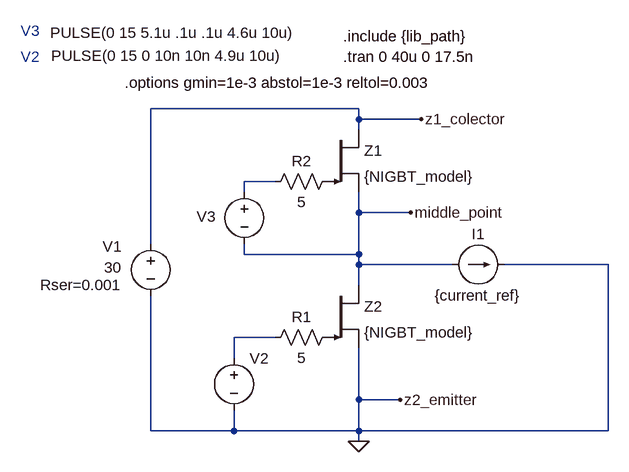
[diagram p0: schematic Abaixador_rv00.asc]
Abaixador_rv00.asc, the LTspice schematic file:
Version 4
SHEET 1 880 824
WIRE -816 -816 -1136 -816
WIRE -816 -800 -816 -816
WIRE -720 -800 -816 -800
WIRE -816 -784 -816 -800
WIRE -944 -704 -992 -704
WIRE -992 -688 -992 -704
WIRE -816 -656 -816 -688
WIRE -736 -656 -816 -656
WIRE -816 -592 -816 -656
WIRE -1136 -608 -1136 -816
WIRE -992 -592 -992 -608
WIRE -816 -592 -992 -592
WIRE -816 -576 -816 -592
WIRE -672 -576 -816 -576
WIRE -432 -576 -592 -576
WIRE -816 -544 -816 -576
WIRE -944 -464 -1008 -464
WIRE -1008 -432 -1008 -464
WIRE -816 -368 -816 -448
WIRE -752 -368 -816 -368
WIRE -1136 -320 -1136 -528
WIRE -1008 -320 -1008 -352
WIRE -1008 -320 -1136 -320
WIRE -816 -320 -816 -368
WIRE -816 -320 -1008 -320
WIRE -432 -320 -432 -576
WIRE -432 -320 -816 -320
WIRE -816 -304 -816 -320
FLAG -816 -304 0
FLAG -720 -800 z1_colector
FLAG -752 -368 z2_emitter
FLAG -736 -656 middle_point
SYMBOL voltage -1136 -624 R0
WINDOW 123 0 0 Left 0
WINDOW 39 -170 79 Left 2
WINDOW 0 -74 20 Left 2
WINDOW 3 -72 52 Left 2
SYMATTR SpiceLine Rser=0.001
SYMATTR InstName V1
SYMATTR Value 30
SYMBOL current -672 -576 R270
WINDOW 0 32 40 VTop 2
WINDOW 3 -32 40 VBottom 2
WINDOW 123 0 0 Left 0
WINDOW 39 0 0 Left 0
SYMATTR InstName I1
SYMATTR Value {current_ref}
SYMBOL res -848 -480 R90
WINDOW 0 0 56 VBottom 2
WINDOW 3 32 56 VTop 2
SYMATTR InstName R1
SYMATTR Value 5
SYMBOL voltage -1008 -448 R0
WINDOW 123 0 0 Left 0
WINDOW 39 0 0 Left 0
WINDOW 3 -281 -450 Left 2
SYMATTR Value PULSE(0 15 0 10n 10n 4.9u 10u)
SYMATTR InstName V2
SYMBOL voltage -992 -704 R0
WINDOW 3 -299 -229 Left 2
WINDOW 123 0 0 Left 0
WINDOW 39 0 0 Left 0
WINDOW 0 -73 54 Left 2
SYMATTR Value PULSE(0 15 5.1u .1u .1u 4.6u 10u)
SYMATTR InstName V3
SYMBOL res -848 -720 R90
WINDOW 0 0 56 VBottom 2
WINDOW 3 32 56 VTop 2
SYMATTR InstName R2
SYMATTR Value 5
SYMBOL Misc\\NIGBT -864 -784 R0
SYMATTR InstName Z1
SYMATTR Value {NIGBT_model}
SYMBOL Misc\\NIGBT -864 -544 R0
SYMATTR InstName Z2
SYMATTR Value {NIGBT_model}
TEXT -840 -896 Left 2 !.tran 0 40u 0 17.5n
TEXT -1336 -936 Left 2 ;V3
TEXT -1336 -896 Left 2 ;V2
TEXT -840 -928 Left 2 !.include {lib_path}
TEXT -1176 -856 Left 2 !.options gmin=1e-3 abstol=1e-3 reltol=0.003

The netlist it stands for:
* Abaixador_rv00.asc
V1 z1_colector 0 30 Rser=0.001
I1 middle_point 0 {current_ref}
R1 P001 N002 5
V2 N002 0 PULSE(0 15 0 10n 10n 4.9u 10u)
V3 N001 middle_point PULSE(0 15 5.1u .1u .1u 4.6u 10u)
R2 P002 N001 5
Z1 z1_colector P002 middle_point {NIGBT_model}
Z2 middle_point P001 0 {NIGBT_model}
.tran 0 40u 0 17.5n
* V3
* V2
.include {lib_path}
.options gmin=1e-3 abstol=1e-3 reltol=0.003
.backanno
.end